# EAGLE design Schematic (EAGLE 6.5.0)
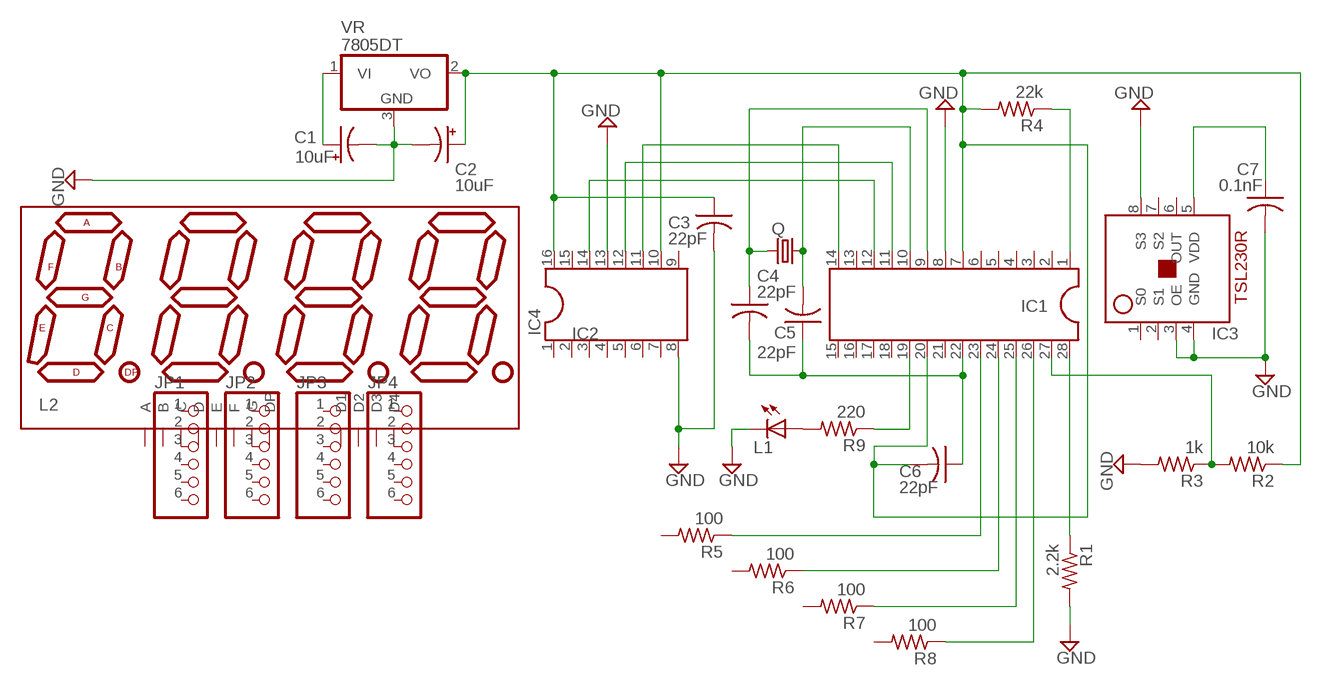
[diagram p0: schematic, sheet 1]

## Parts
C1  10uF  CPOL-US140CLH-1010  [140CLH-1010]
C2  10uF  CPOL-US140CLH-1010  [140CLH-1010]
C3  22pF  C-US025-024X044  [C025-024X044]
C4  22pF  C-US025-024X044  [C025-024X044]
C5  22pF  C-US025-024X044  [C025-024X044]
C6  22pF  C-US025-024X044  [C025-024X044]
C7  0.1nF  C-US025-024X044  [C025-024X044]
IC1  DIL28  [DIL28-6]
IC3  LIGHT_TO_FREQ_CONVERTER  [LIGHT_TO_FREQ_CONVERTER]
IC4  DIL16  [DIL16]
JP1  PINHD-1X6CLEAN  [1X06-CLEAN]
JP2  PINHD-1X6CLEAN  [1X06-CLEAN]
JP3  PINHD-1X6CLEAN  [1X06-CLEAN]
JP4  PINHD-1X6CLEAN  [1X06-CLEAN]
L1  LEDIRL80A  [IRL80A]
Q  CRYSTALHC49S  [HC49/S]
R1  2.2k  R-US_0207/12  [0207/12]
R2  10k  R-US_0207/12  [0207/12]
R3  1k  R-US_0207/12  [0207/12]
R4  22k  R-US_0207/12  [0207/12]
R5  100  R-US_0207/12  [0207/12]
R6  100  R-US_0207/12  [0207/12]
R7  100  R-US_0207/12  [0207/12]
R8  100  R-US_0207/12  [0207/12]
R9  220  R-US_0207/12  [0207/12]
U$1  7-SEGMENT-4DIGIT-COUNTERPTH  [7-SEGMENT-4DIGIT-COUNTER]
VR  7805DT  [TO252]

## Nets
GND: C1.- C2.- C3.2 C7.2 IC1.8 IC3.3(OE) IC3.4(GND) IC3.8(S3) IC4.8 IC4.13 L1.K(C) R1.2 R3.2 VR.3(GND)
N$1: IC1.24 R6.1
N$2: IC1.23 R5.1
N$3: IC1.25 R7.1
N$4: IC1.26 R8.1
N$5: IC1.28 R1.1
N$6: IC1.19 R9.1
N$7: L1.A R9.2
N$9: IC1.11 IC4.12
N$10: C4.2 C5.1 C6.1 IC1.22
N$11: C1.+ VR.1(VI)
N$12: JP1.3 U$1.4(C)
N$13: IC1.12 IC4.14
N$14: C4.1 IC1.9 Q.2
N$15: C2.+ C3.1 C6.2 IC1.7 IC1.20 IC4.10 IC4.16 R2.1 R4.2 VR.2(VO)
N$16: IC1.1 R4.1
N$17: IC1.14 IC4.11
N$18: C7.1 IC3.5(VDD)
N$19: JP2.3 U$1.5(G)
N$20: JP4.3 U$1.6(D4)
N$36: IC1.27 R2.2 R3.1
N$37: C5.2 IC1.10 Q.1
Unconnected: IC1.2 IC1.3 IC1.4 IC1.5 IC1.6 IC1.13 IC1.15 IC1.16 IC1.17 IC1.18 IC1.21 IC3.1(S0) IC3.2(S1) IC3.6(OUT) IC3.7(S2) IC4.1 IC4.2 IC4.3 IC4.4 IC4.5 IC4.6 IC4.7 IC4.9 IC4.15 JP1.1 JP1.2 JP1.4 JP1.5 JP1.6 JP2.1 JP2.2 JP2.4 JP2.5 JP2.6 JP3.1 JP3.2 JP3.3 JP3.4 JP3.5 JP3.6 JP4.1 JP4.2 JP4.4 JP4.5 JP4.6 R5.2 R6.2 R7.2 R8.2 U$1.1(E) U$1.2(D) U$1.3(DP) U$1.7(B) U$1.8(D3) U$1.9(D2) U$1.10(F) U$1.11(A) U$1.12(D1)

## Notes on the sheet
- IC2 | IC3
- L2

## Library data of the parts
C1 C2 = adafruit:CPOL-US: POLARIZED CAPACITOR, American symbol
C3-C7 = adafruit:C-US: CAPACITOR, American symbol
IC1 = ic-package:DIL28: Dual In Line
IC3 = open_source_turbidimeter:LIGHT_TO_FREQ_CONVERTER
IC4 = ic-package:DIL16: Dual In Line / Socket
JP1-JP4 = adafruit:PINHD-1X6: PIN HEADER
L1 = adafruit:LED: LED OSRAM: - CHIPLED LG R971, LG N971, LY N971, LG Q971, LY Q971, LO R971, LY R971 LH N974, LH R974 LS Q976, LO Q976, LY Q976 LO Q996 - Hyper CHIPLED LW Q18S LB Q993, LB Q99A, LB R99A - SideLED LS A670, LO A670, LY A670, LG A670, LP A670 LB A673, LV A673, LT A673, LW A673 LH A674 LY A675 LS A676, LA A676, LO A676, LY A676, LW A676 LS A679, LY A679, LG A679 - Hyper Micro SIDELED® LS Y876, LA Y876, LO Y876, LY Y876 LT Y87S - SmartLED LW L88C, LW L88S LB L89C, LB L89S, LG L890 LS L89K, LO L89K, LY L89K LS L896, LA L896, LO L896, LY L896 - TOPLED LS T670, LO T670, LY T670, LG T670, LP T670 LSG T670, LSP T670, LSY T670, LOP T670, LYG T670 LG T671, LOG T671, LSG T671 LB T673, LV T673, LT T673, LW T673 LH T674 LS T676, LA T676, LO T676, LY T676, LB T676, LH T676, LSB T676, LW T676 LB T67C, LV T67C, LT T67C, LS T67K, LO T67K, LY T67K, LW E67C LS E67B, LA E67B, LO E67B, LY E67B, LB E67C, LV E67C, LT E67C LW T67C LS T679, LY T679, LG T679 LS T770, LO T770, LY T770, LG T770, LP T770 LB T773, LV T773, LT T773, LW T773 LH T774 LS E675, LA E675, LY E675, LS T675 LS T776, LA T776, LO T776, LY T776, LB T776 LHGB T686 LT T68C, LB T68C - Hyper Mini TOPLED® LB M676 - Mini TOPLED Santana® LG M470 LS M47K, LO M47K, LY M47K Source: http://www.osram.convergy.de/
Q = adafruit:CRYSTAL: CRYSTAL; OC_FARNELL: 1667008; OC_NEWARK: unknown
R1-R9 = adafruit:R-US_: RESISTOR, American symbol
U$1 = SparkFun-Displays:7-SEGMENT-4DIGIT-COUNTER
VR = linear:78*: Positive VOLTAGE REGULATOR Source: http://cache.national.com/ds/LM/LM78L05.pdf http://www.fairchildsemi.com/ds/LM/LM7805.pdf

## Board
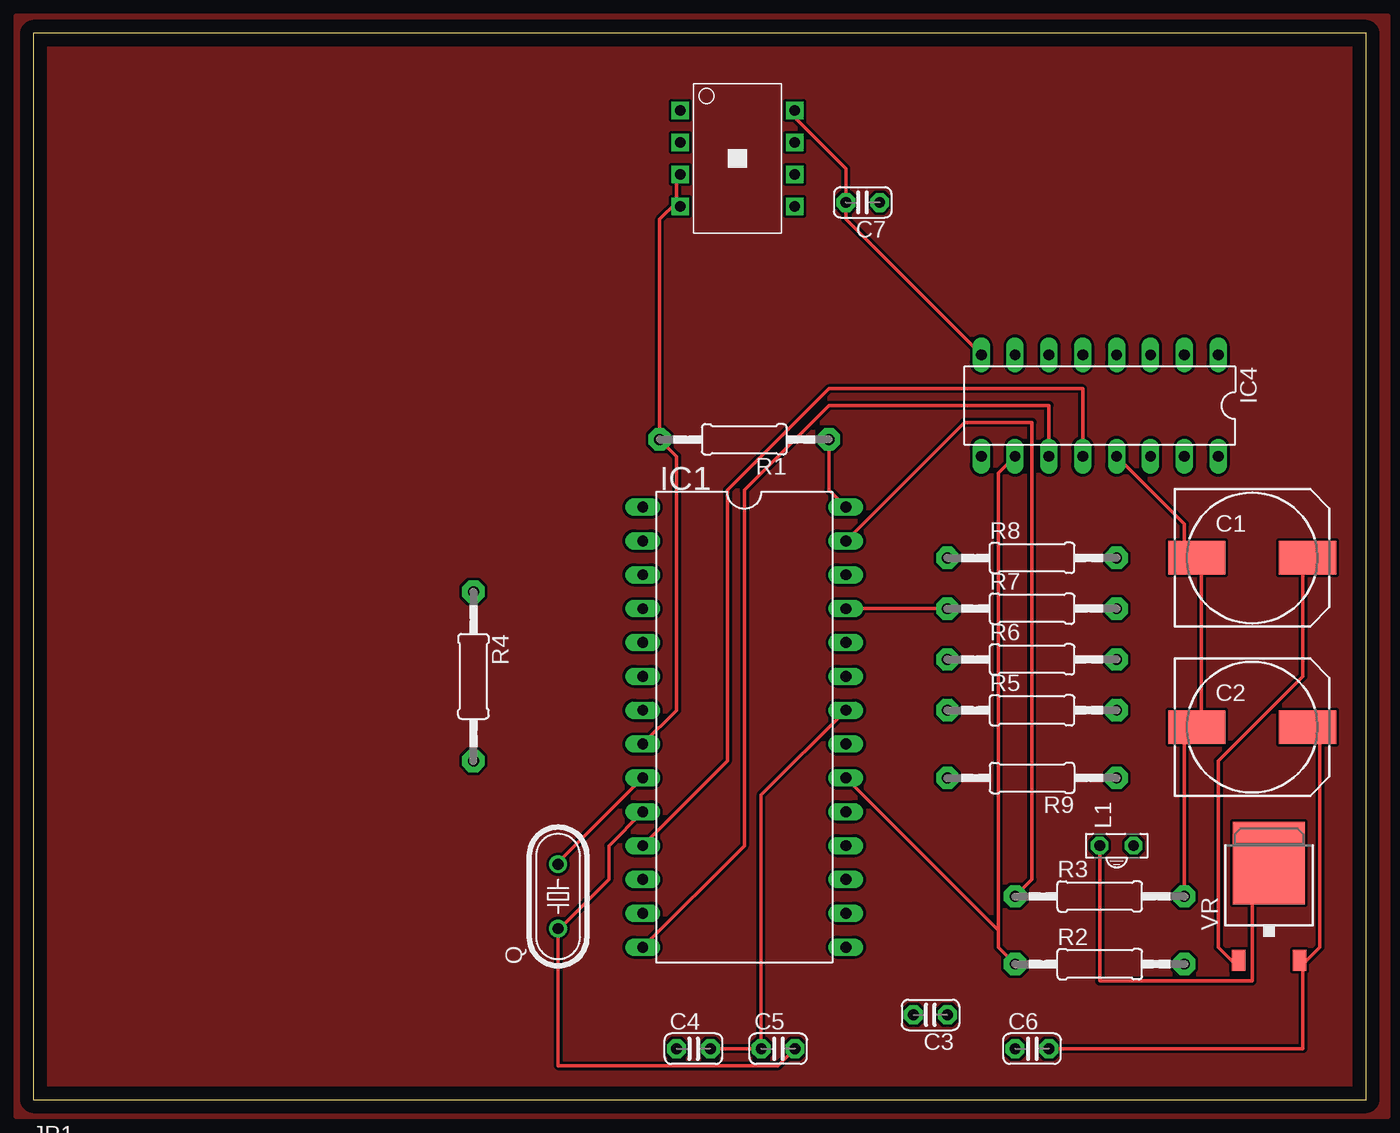
[diagram p1: board, top side]
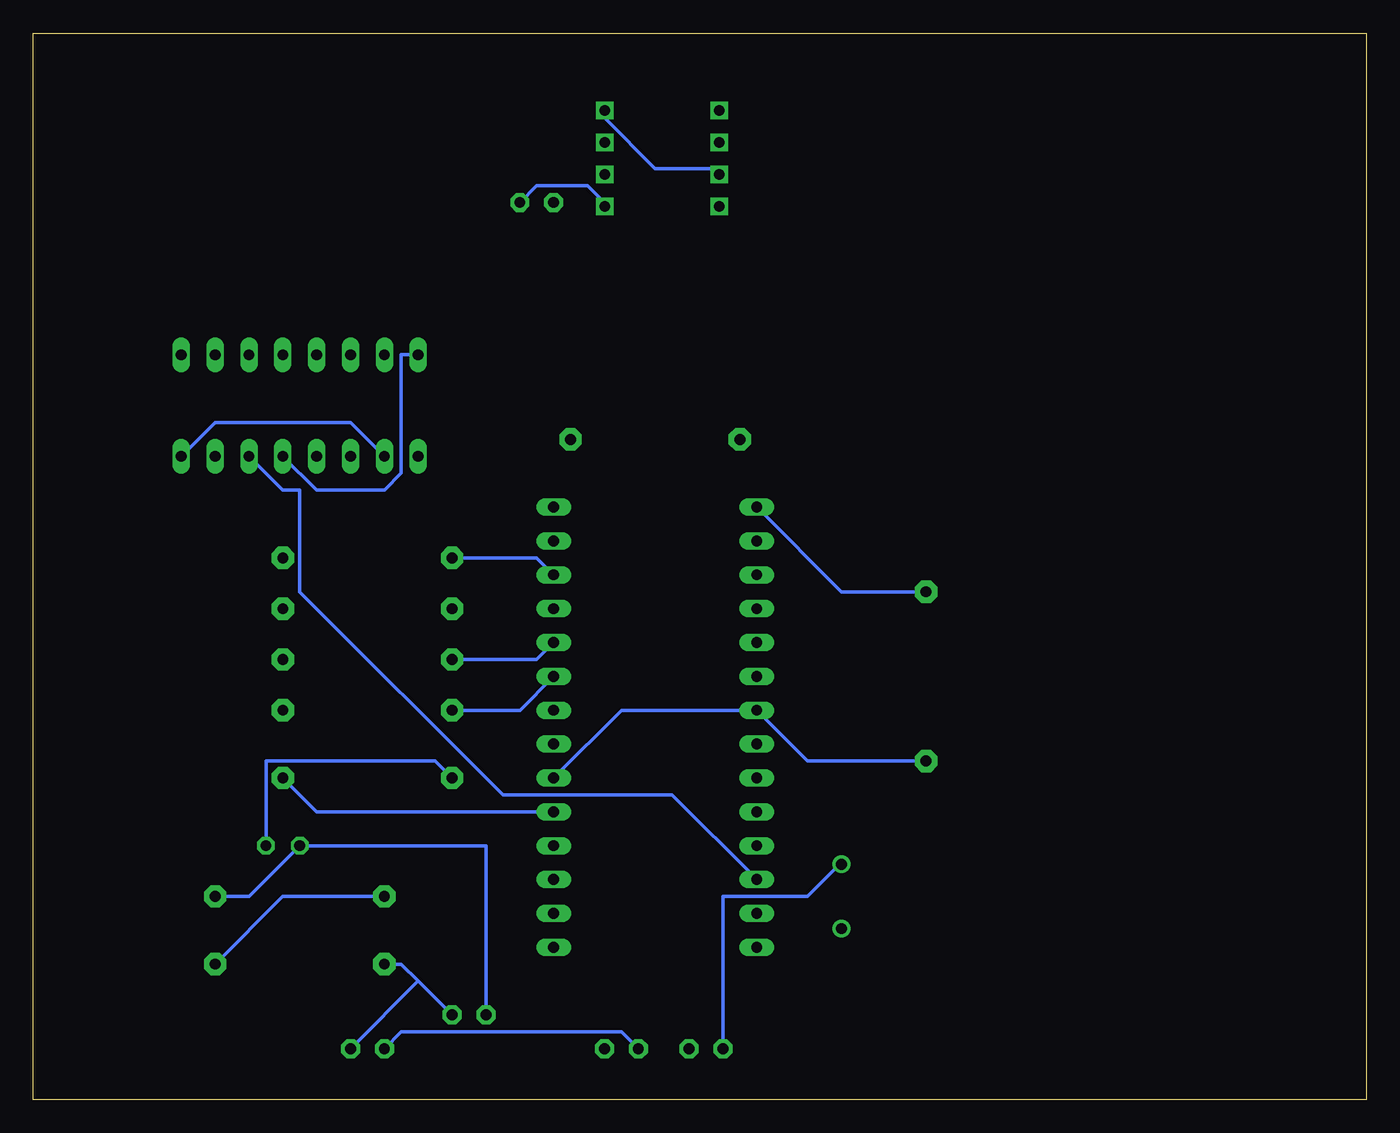
[diagram p2: board, bottom side, seen from below]

Size 100 x 80 mm. Coordinates in mm from the lower left corner, seen from the top.
Outline: 0,0 100,0 100,80 0,80 0,0
Copper layers (1*16): Top 0.035mm / dielectric 1.5mm / Bottom 0.035mm
Design rules "default": minimum track width 10mil, minimum drill 24mil, track to track 8mil, track to pad 8mil, pad to pad 8mil, via to via 8mil, smd to smd 8mil, copper to edge 40mil, drill to drill 8mil, minimum pad ring 10mil, minimum via ring 8mil, stop-mask expansion 4mil, vias tented up to drill 0mil, thermal gap 10mil

### Footprints (pad centres in the part's own frame; a part is rotated, then mirrored left to right if it is on the bottom)
140CLH-1010 = smd 4.3 x 2.5: + 4.15,0; - -4.15,0
C025-024X044 = drill 0.813 pad 1.422 octagon: 1 -1.27,0; 2 1.27,0
DIL28-6 = drill 0.813 long: 1 -16.51,-7.62; 2 -13.97,-7.62; 3 -11.43,-7.62; 4 -8.89,-7.62; 5 -6.35,-7.62; 6 -3.81,-7.62; 7 -1.27,-7.62; 8 1.27,-7.62; 9 3.81,-7.62; 10 6.35,-7.62; 11 8.89,-7.62; 12 11.43,-7.62; 13 13.97,-7.62; 14 16.51,-7.62; 15 16.51,7.62; 16 13.97,7.62; 17 11.43,7.62; 18 8.89,7.62; 19 6.35,7.62; 20 3.81,7.62; 21 1.27,7.62; 22 -1.27,7.62; 23 -3.81,7.62; 24 -6.35,7.62; 25 -8.89,7.62; 26 -11.43,7.62; 27 -13.97,7.62; 28 -16.51,7.62
LIGHT_TO_FREQ_CONVERTER = drill 0.8 square: 1 2,-1; 2 4.39,-1; 3 6.79,-1; 4 9.18,-1; 5 9.18,7.6; 6 6.78,7.6; 7 4.39,7.6; 8 2,7.6
DIL16 = drill 0.813 long: 1 -8.89,-3.81; 2 -6.35,-3.81; 3 -3.81,-3.81; 4 -1.27,-3.81; 5 1.27,-3.81; 6 3.81,-3.81; 7 6.35,-3.81; 8 8.89,-3.81; 9 8.89,3.81; 10 6.35,3.81; 11 3.81,3.81; 12 1.27,3.81; 13 -1.27,3.81; 14 -3.81,3.81; 15 -6.35,3.81; 16 -8.89,3.81
1X06-CLEAN = drill 1.016 octagon: 1 -6.35,0; 2 -3.81,0; 3 -1.27,0; 4 1.27,0; 5 3.81,0; 6 6.35,0
IRL80A = drill 0.813 octagon: A 0,-1.27; K 0,1.27
HC49/S = drill 0.813: 1 -2.413,0; 2 2.413,0
0207/12 = drill 0.813 pad 1.676 octagon: 1 -6.35,0; 2 6.35,0
7-SEGMENT-4DIGIT-COUNTER = drill 0.9 pad 1.88: 1 -6.35,-10.998; 2 -3.81,-10.998; 3 -1.27,-10.998; 4 1.27,-10.998; 5 3.81,-10.998; 6 6.35,-10.998; 7 6.35,10.998; 8 3.81,10.998; 9 1.27,10.998; 10 -1.27,10.998; 11 -3.81,10.998; 12 -6.35,10.998
TO252 = smd 1 x 1.6: 1 -2.28,-4.8; 2 2.28,-4.8 | smd 5.4 x 6.2: 3 0,2.5

### Placement (x,y rotation side)
C1  91.44,40.64 0 top
C2  91.44,27.94 0 top
C3  67.31,6.35 180 top
C4  49.53,3.81 0 top
C5  55.88,3.81 0 top
C6  74.93,3.81 0 top
C7  62.23,67.31 180 top
IC1  53.34,27.94 270 top
IC3  49.53,76.2 270 top
IC4  80.01,52.07 180 top
JP1  7.62,-5.08 0 top  (outside the outline)
JP2  7.62,-10.16 0 top  (outside the outline)
JP3  7.62,-15.24 0 top  (outside the outline)
JP4  7.62,-20.32 0 top  (outside the outline)
L1  81.28,19.05 90 top
Q  39.37,15.24 90 top
R1  53.34,49.53 180 top
R2  80.01,10.16 0 top
R3  80.01,15.24 0 top
R4  33.02,31.75 270 top
R5  74.93,29.21 0 top
R6  74.93,33.02 0 top
R7  74.93,36.83 0 top
R8  74.93,40.64 0 top
R9  74.93,24.13 180 top
U$1  31.75,-35.56 0 top  (outside the outline)
VR  92.71,15.24 0 top

### Tracks (layer width: path | path; a pad name or v marks a point on that pad's centre or on a via)
GND
  Top 0.254: IC4.13 86.36,43.18 86.36,40.64 C1.- 87.63,40.64 87.63,27.94 C2.- 86.36,27.94 R3.2 | L1.K 80.01,8.89 91.44,8.89 91.44,15.24 92.71,16.51 VR.3 | IC3.8 57.15,73.66 60.96,69.85 C7.2 60.96,66.04 IC4.8 | 48.26,67.31 48.26,69.85 IC3.3 | IC1.8 48.26,29.21 48.26,48.26 R1.2 46.99,66.04 48.26,67.31 | 48.26,67.31 IC3.4
  Bottom 0.254: R3.2 83.82,15.24 L1.K 66.04,19.05 C3.2 | IC3.8 57.15,73.66 53.34,69.85 48.26,69.85 IC3.3 | IC4.13 78.74,45.72 73.66,45.72 72.39,46.99 72.39,55.88 IC4.8
N$1
  Bottom 0.254: IC1.24 62.23,33.02 R6.1
N$2
  Bottom 0.254: IC1.23 63.5,29.21 R5.1
N$3
  Top 0.254: R7.1 IC1.25
N$4
  Bottom 0.254: IC1.26 62.23,40.64 R8.1
N$5
  Top 0.254: IC1.28 59.69,45.72 R1.1
N$6
  Bottom 0.254: IC1.19 78.74,21.59 R9.1
N$7
  Bottom 0.254: L1.A 82.55,25.4 69.85,25.4 R9.2
N$8
  pour Top: -1.27,81.28 -1.27,-1.27 101.6,-1.27 101.6,81.28
N$9
  Top 0.254: IC1.11 52.07,25.4 52.07,45.72 59.69,53.34 78.74,53.34 IC4.12
N$10
  Top 0.254: IC1.22 54.61,22.86 C5.1 C4.2
  Bottom 0.254: C6.1 72.39,5.08 55.88,5.08 C5.1
N$11
  Top 0.254: VR.1 90.17,10.16 88.9,11.43 88.9,25.4 95.25,31.75 95.25,40.64 C1.+
N$12  (1 unrouted)
N$13
  Bottom 0.254: IC1.12 52.07,22.86 64.77,22.86 80.01,38.1 80.01,45.72 81.28,45.72 IC4.14
N$14
  Top 0.254: IC1.9 39.37,17.78 Q.2
  Bottom 0.254: C4.1 48.26,15.24 41.91,15.24 39.37,17.78 Q.2
N$15
  Top 0.254: 95.25,10.16 96.52,11.43 96.52,27.94 C2.+ | C6.2 95.25,3.81 95.25,10.16 | 95.25,10.16 VR.2 | IC4.10 72.39,46.99 72.39,12.7 | 72.39,12.7 72.39,11.43 R2.1 | 72.39,12.7 IC1.20
  Bottom 0.254: R4.2 41.91,25.4 IC1.7 55.88,29.21 IC1.20 | IC4.10 76.2,50.8 86.36,50.8 IC4.16 | 71.12,8.89 72.39,10.16 R2.1 | 71.12,8.89 C3.1 | 71.12,8.89 C6.2
N$16
  Bottom 0.254: IC1.1 39.37,38.1 R4.1
N$17
  Top 0.254: IC1.14 53.34,19.05 53.34,45.72 59.69,52.07 76.2,52.07 IC4.11
N$18
  Bottom 0.254: C7.1 62.23,68.58 58.42,68.58 57.15,67.31 IC3.5
N$19  (1 unrouted)
N$20  (1 unrouted)
N$36
  Top 0.254: IC1.27 69.85,50.8 74.93,50.8 74.93,16.51 R3.1
  Bottom 0.254: R2.2 81.28,15.24 R3.1
N$37
  Top 0.254: 39.37,12.7 43.18,16.51 43.18,19.05 IC1.10 | C5.2 55.88,2.54 39.37,2.54 39.37,12.7 | 39.37,12.7 Q.1